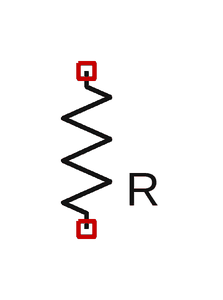
[diagram p0: schematic valid_04.asc]
valid_04.asc, the LTspice schematic file:
Version 4.1
SHEET 3 976 680
SYMBOL res 0 0 R0

The netlist it stands for:
* valid_04.asc
R§? NC_01 NC_02 R
.backanno
.end